# EAGLE schematic 14KEY (EAGLE 9.6.1)
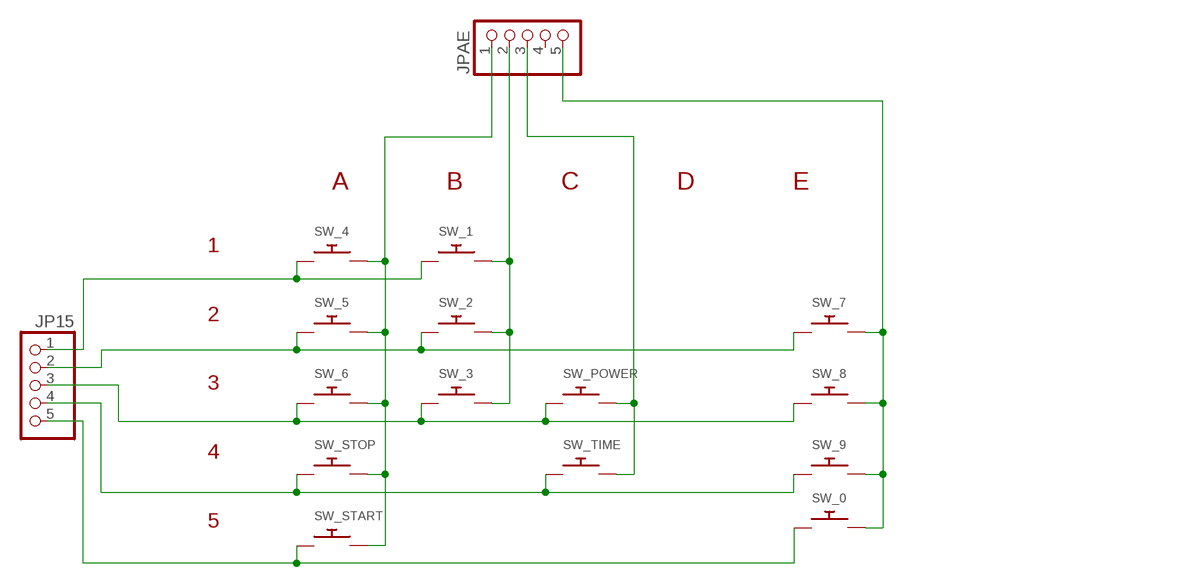
[diagram p0: schematic, sheet 1]

## Parts
JP15  PINHD-1X5  [1X05]
JPAE  PINHD-1X5  [1X05]
SW_0  SWITCH_PUSHBUTTONEVQ-PE  [TACT_PANA-EVQ]
SW_1  SWITCH_PUSHBUTTONEVQ-PE  [TACT_PANA-EVQ]
SW_2  SWITCH_PUSHBUTTONEVQ-PE  [TACT_PANA-EVQ]
SW_3  SWITCH_PUSHBUTTONEVQ-PE  [TACT_PANA-EVQ]
SW_4  SWITCH_PUSHBUTTONEVQ-PE  [TACT_PANA-EVQ]
SW_5  SWITCH_PUSHBUTTONEVQ-PE  [TACT_PANA-EVQ]
SW_6  SWITCH_PUSHBUTTONEVQ-PE  [TACT_PANA-EVQ]
SW_7  SWITCH_PUSHBUTTONEVQ-PE  [TACT_PANA-EVQ]
SW_8  SWITCH_PUSHBUTTONEVQ-PE  [TACT_PANA-EVQ]
SW_9  SWITCH_PUSHBUTTONEVQ-PE  [TACT_PANA-EVQ]
SW_POWER  SWITCH_PUSHBUTTONEVQ-PE  [TACT_PANA-EVQ]
SW_START  SWITCH_PUSHBUTTONEVQ-PE  [TACT_PANA-EVQ]
SW_STOP  SWITCH_PUSHBUTTONEVQ-PE  [TACT_PANA-EVQ]
SW_TIME  SWITCH_PUSHBUTTONEVQ-PE  [TACT_PANA-EVQ]

## Nets
1: JP15.1 SW_1.P$1 SW_4.P$1
2: JP15.2 SW_2.P$1 SW_5.P$1 SW_7.P$1
3: JP15.3 SW_3.P$1 SW_6.P$1 SW_8.P$1 SW_POWER.P$1
4: JP15.4 SW_9.P$1 SW_STOP.P$1 SW_TIME.P$1
5: JP15.5 SW_0.P$1 SW_START.P$1
A: JPAE.1 SW_4.P$2 SW_5.P$2 SW_6.P$2 SW_START.P$2 SW_STOP.P$2
B: JPAE.2 SW_1.P$2 SW_2.P$2 SW_3.P$2
C: JPAE.3 SW_POWER.P$2 SW_TIME.P$2
E: JPAE.5 SW_0.P$2 SW_7.P$2 SW_8.P$2 SW_9.P$2
Unconnected: JPAE.4

## Notes on the sheet
- A              B              C              D              E
- 1
  
  
  2
  
  
  3
  
  
  4
  
  
  5

## Library data of the parts
JP15 JPAE = pinhead:PINHD-1X5: PIN HEADER
SW_0 SW_1-SW_9 SW_POWER SW_START SW_STOP SW_TIME = adafruit:SWITCH_PUSHBUTTON: Buttons SOFTTOUCHSMD_SJ - Soft touch temporary push button (Super Junk Akihabara) Compatible with SKPMANE010 [Mouser: 688-SKPMAN] C&K_KSS = Digikey: KSS221GLFS